# Altium schematic sheet Power_Reg.SchDoc
size A4
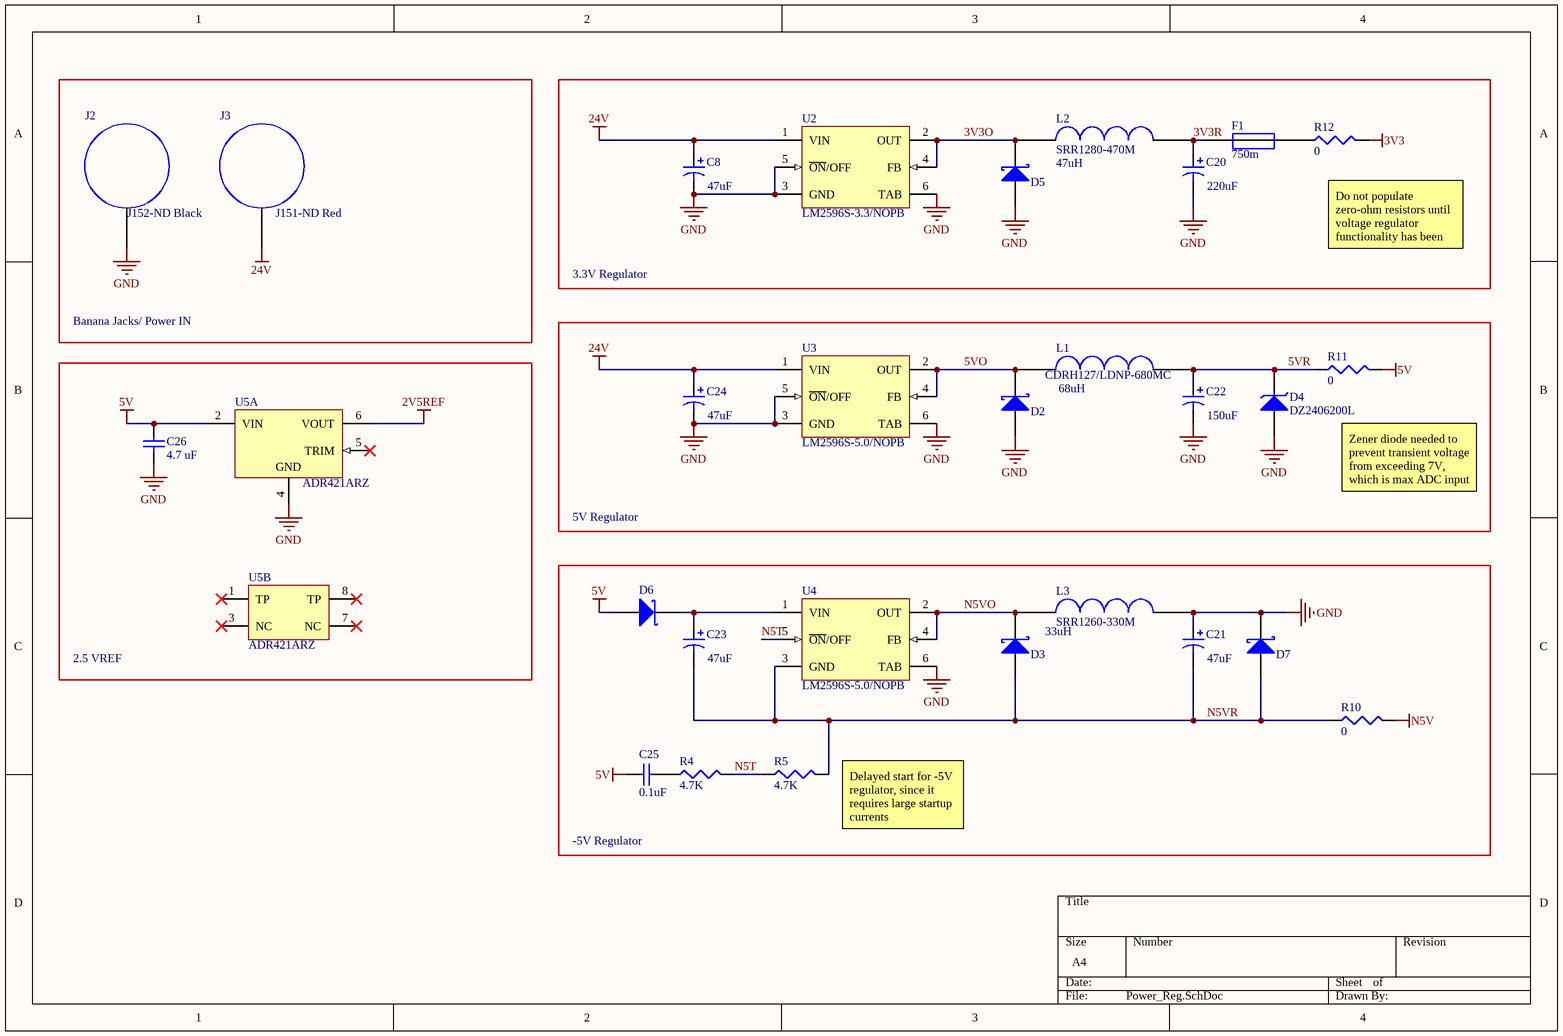
[diagram p0: Power_Reg.SchDoc]

## Parts
C8  value 47uF  [7343]  (hidden comment: 399-3905-2-ND)
C20  value 220uF  [7343]  (hidden comment: 399-10429-1-ND)
C21  value 47uF  [7343]  (hidden comment: 399-3905-2-ND)
C22  value 150uF  [7343]  (hidden comment: 399-3778-1-ND)
C23  value 47uF  [7343]  (hidden comment: 399-3905-2-ND)
C24  value 47uF  [7343]  (hidden comment: 399-3905-2-ND)
C25  value 0.1uF  [0402]  (hidden comment: C0402)
C26  value 4.7 uF  [0603]  (hidden comment: C0603)
D2  PMEG4050EP,115  [PMEG4050EP,115]  (value not drawn)
D3  PMEG4050EP,115  [PMEG4050EP,115]  (value not drawn)
D4  DZ2406200L  [DZ2406200L]
D5  PMEG4050EP,115  [PMEG4050EP,115]  (value not drawn)
D6  RSX501L-20TE25  [RSX501L-20TE25]  (value not drawn)
D7  PMEG4050EP,115  [PMEG4050EP,115]  (value not drawn)
F1  value 750m  [1206]  (hidden comment: TR/3216FF750-R)
J2  J152-ND Black  [Banana Jack]
J3  J151-ND Red  [Banana Jack]
L1  CDRH127/LDNP-680MC  value 68uH  [CDRH127/LDNP-680MC]
L2  SRR1280-470M  value 47uH  [SRR1280-470M]
L3  SRR1260-330M  value 33uH  [SRR1260-330M]
R4  value 4.7K  [J1-0603]  (hidden comment: Res3)
R5  value 4.7K  [J1-0603]  (hidden comment: Res3)
R10  value 0  [0805]  (hidden comment: 5106)
R11  value 0  [0805]  (hidden comment: 5106)
R12  value 0  [0805]  (hidden comment: 5106)
U2  LM2596S-3.3/NOPB  [TS5B_M]
U3  LM2596S-5.0/NOPB  [TS5B_M]
U4  LM2596S-5.0/NOPB  [TS5B_N]
U5  ADR421ARZ  [ADI-R-8_N]  (parts A,B of 2)

## Blocks framed on the sheet
Banana Jacks/ Power IN: J2 J3
3.3V Regulator: C8 C20 D5 F1 L2 R12 U2
5V Regulator: C22 C24 D2 D4 L1 R11 U3
2.5 VREF: C26 U5
-5V Regulator: C21 C23 C25 D3 D6 D7 L3 R4 R5 R10 U4

## Nets
2V5REF: U5.6(VOUT)
3V3: R12.2
5V: C25.2 C26.1 D6.1(A) R11.2 U5.2(VIN)
24V: C8.1 C24.1 J3.1 U2.1(VIN) U3.1(VIN)
GND: C8.2 C20.2 C21.1 C22.2 C24.2 C26.2 D2.1(A) D4.1(A) D5.1(A) D7.2(K) J2.1 L3.2 U2.3(GND) U2.5(~{ON}/OFF) U2.6(TAB) U3.3(GND) U3.5(~{ON}/OFF) U3.6(TAB) U4.6(TAB) U5.4(GND)
N5V: R10.2
3V3O: D5.2(K) L2.1 U2.2(OUT) U2.4(FB)
3V3R: C20.1 F1.1 L2.2
5VO: D2.2(K) L1.1 U3.2(OUT) U3.4(FB)
5VR: C22.1 D4.2(K) L1.2 R11.1
N5T: R4.2 R5.1 U4.5(~{ON}/OFF)
N5VO: D3.2(K) L3.1 U4.2(OUT) U4.4(FB)
N5VR: C21.2 C23.2 D3.1(A) D7.1(A) R5.2 R10.1 U4.3(GND)
NetC23_1: C23.1 D6.2(K) U4.1(VIN)
NetC25_1: C25.1 R4.1
NetF1_2: F1.2 R12.1

Not connected (* = marked no-connect by the designer): U5 1(TP)* 3(NC)* 5(TRIM)* 7(NC)* 8(TP)*

## Notes on the sheet
- (near R12) Do not populate zero-ohm resistors until voltage regulator functionality has been verified
- Zener diode needed to prevent transient voltage from exceeding 7V, which is max ADC input voltage
- (near R5) Delayed start for -5V regulator, since it requires large startup currents

## Library data of the parts
C8 C21 C23 C24 = CWR11DH476M: CAP TANT 47UF 35V 10% 2917; Note: See Data Sheet for full range of components; Published: 19-Mar-2004; DatasheetDocument: 20-Mar-2003; PackageReference: 7343; Publisher: Altium Limited; Code_JEITA: 7343; ComponentLink1Description: Manufacturer Link; ComponentLink1URL: http://www.vishay.com/; ComponentLink2Description: Datasheet; Supplier Part Number 1: 399-3905-1-ND; Supplier: Digikey
C20 = CWR11DH476M: CAP TANT 220uF 16V 10% 2917; Note: See Data Sheet for full range of components; Published: 19-Mar-2004; DatasheetDocument: 20-Mar-2003; PackageReference: 7343; Publisher: Altium Limited; Code_JEITA: 7343; ComponentLink1Description: Manufacturer Link; ComponentLink1URL: http://www.vishay.com/; ComponentLink2Description: Datasheet; Supplier Part Number 1: 399-10429-1-ND; Supplier: Digikey
C22 = CWR11DH476M: CAP TANT 150UF 10V 10% 2917; Note: See Data Sheet for full range of components; Published: 19-Mar-2004; DatasheetDocument: 20-Mar-2003; PackageReference: 7343; Publisher: Altium Limited; Code_JEITA: 7343; ComponentLink1Description: Manufacturer Link; ComponentLink1URL: http://www.vishay.com/; ComponentLink2Description: Datasheet; Supplier Part Number 1: 399-3778-1-ND; Supplier: Digikey
C25 = C0402: Ceramic Chip Capacitor - Standard; Note: Footprint corresponds to dimensions for bulk cassette packaging. This case size has tightened tolerances.; Published: 17-Jul-2002; LatestRevisionDate: 19-Mar-2004; LatestRevisionNote: Silkscreen size reduced.; DatasheetDocument: Mar-2001; PackageDocument: Mar-2001; PackageReference: 0402; Publisher: Altium Limited; Code_JEITA: 0402; Code_IPC: 1005 [0402]; ComponentLink1Description: Manufacturer Link; ComponentLink1URL: http://www.kemet.com/; ComponentLink2Description: Datasheet; ComponentLink2URL: http://www.kemet.com/kemet/web/homepage/kechome.nsf/vapubfilesname/F3102TA.pdf/$file/F3102TA.pdf; Supplier Part Number 1: 1276-1443-1-ND; Supplier 1: Digikey
C26 = C0603: Ceramic Chip Capacitor - Standard; Note: Footprint corresponds to dimensions for bulk cassette packaging. This case size has tightened tolerances.; Published: 17-Jul-2002; LatestRevisionDate: 19-Mar-2004; LatestRevisionNote: Silkscreen size reduced.; DatasheetDocument: Mar-2001; PackageDocument: Mar-2001; PackageReference: 0603; Publisher: Altium Limited; Code_JEITA: 0603; Code_IPC: 1608 [0603]; ComponentLink1Description: Manufacturer Link; ComponentLink1URL: http://www.kemet.com/; ComponentLink2Description: Datasheet; ComponentLink2URL: http://www.kemet.com/kemet/web/homepage/kechome.nsf/vapubfilesname/F3102TA.pdf/$file/F3102TA.pdf; Supplier Part Number 1: 445-7478-1-ND; Supplier 1: Digikey
D2 D3 D5 D7 = PMEG4050EP,115: Schottky Diode, 5A, 40V, SOD-128 Package; Supplier 1: Digikey; Supplier Part Number 1: 568-7408-1-ND
D4 = DZ2406200L: DIODE ZENER 6.2V 2W TMINIP2. SOD-128; Supplier 1: Digikey; Supplier Part Number 1: DZ2406200LCT-ND
D6 = RSX501L-20TE25: DIODE SCHOTTKY 20V 5A PMDS; Supplier 1: Digikey; Supplier Part Number 1: RSX501L-20TE25CT-ND
F1 = SF-0402F075-2: FUSE BOARD MNT 750MA 32VAC 63VDC; Supplier 1: Digikey; Supplier Part Number 1: 283-2540-1-ND
J2 = J-152-ND - Black: CONN JACK BANANA INSUL NYLON BLA; Supplier Part Number 1: J152-ND; Supplier 1: Digikey
J3 = J151-ND Red: CONN JACK BANANA INSUL NYLON RED; Supplier Part Number 1: J151-ND; Supplier 1: Digikey
L1 = CDRH127/LDNP-680MC: Non-standard package, shielded inductor, 68uH, 2.5A; Supplier 1: Digikey; Supplier Part Number 1: 308-1341-1-ND
L2 = SRR1280-470M: Non-standard, shielded, 47uH inductor; Supplier 1: Digikey; Supplier Part Number 1: SRR1280-470MCT-ND
L3 = SRR1260-330M: Non-standard, shielded, inductor, 33uH; Supplier Part Number 1: SRR1260-330M; Supplier 1: Digikey
R4 R5 = Res3: Resistor; Published: 8-Jun-2000; LatestRevisionDate: 29-May-2009; LatestRevisionNote: IPC-7351 Footprint Added.; PackageReference: J1-0603; Publisher: Altium Limited; PackageDescription: Chip Resistor; Supplier Part Number 1: 311-4.7KGRCT-ND; Supplier: Digikey
R10-R12 = Res3: RES SMD 0.0 OHM JUMPER 1/2W 0805; Published: 8-Jun-2000; LatestRevisionDate: 29-May-2009; LatestRevisionNote: IPC-7351 Footprint Added.; PackageReference: J1-0603; Publisher: Altium Limited; PackageDescription: Chip Resistor; Supplier 1: Digikey; Supplier Part Number 1: 36-5106CT-ND
U2 = LM2596S-3.3/NOPB: SIMPLE SWITCHER® Power Converter 150 KHz 3A Step-Down Voltage Regulator, 5-pin TO-263, Pb-Free; Manufacturer: National Semiconductor; PackageTopMarking: NSUZXYTTE#*LM2596S*-3.3 P+; PowerWise: N; High-Reliability: Y; DatasheetVersion: May-2002; PackageVersion: revD, Apr-2005; PackageReference: TS5B; PackageDescription: TO-263, Molded, .400 x .390 x .180in, 5 Lead, .067in Pitch, Surface Mount; PartNumber: LM2596S-3.3/NOPB; RoHS: Y; PinCount: 5; CompType: Switcher; Code_JEDEC: MO-169-AB; ComponentLink1Description: Manufacturer URL; ComponentLink1URL: http://www.national.com/; ComponentLink2Description: LM2596 Datasheet; ComponentLink2URL: http://www.national.com/ds/LM/LM2596.pdf; ComponentLink3Description: LM2596 Web Page; ComponentLink3URL: http://www.national.com/pf/LM/LM2596.html; ComponentLink4Description: TS5B Package Page; ComponentLink4URL: http://www.national.com/packaging/folders/ts5b.html
U3 U4 = LM2596S-5.0/NOPB: SIMPLE SWITCHER® Power Converter 150 KHz 3A Step-Down Voltage Regulator, 5-pin TO-263, Pb-Free; Manufacturer: National Semiconductor; PackageTopMarking: NSUZXYTTE#*LM2596S*-5.0 P+; PowerWise: N; High-Reliability: Y; DatasheetVersion: May-2002; PackageVersion: revD, Apr-2005; PackageReference: TS5B; PackageDescription: TO-263, Molded, .400 x .390 x .180in, 5 Lead, .067in Pitch, Surface Mount; PartNumber: LM2596S-5.0/NOPB; RoHS: Y; PinCount: 5; CompType: Switcher; Code_JEDEC: MO-169-AB; ComponentLink1Description: Manufacturer URL; ComponentLink1URL: http://www.national.com/; ComponentLink2Description: LM2596 Datasheet; ComponentLink2URL: http://www.national.com/ds/LM/LM2596.pdf; ComponentLink3Description: LM2596 Web Page; ComponentLink3URL: http://www.national.com/pf/LM/LM2596.html; ComponentLink4Description: TS5B Package Page; ComponentLink4URL: http://www.national.com/packaging/folders/ts5b.html
U5 = ADR421ARZ: Ultraprecision, Low Noise, XFET(R) Voltage Reference, 2.5 V Output, 4.5 to 18 V Supply, Industrial, 8-pin SOIC (R-8), Tube; Manufacturer: Analog Devices; Max V Supply (V): 18; Min V Supply (V): 4.5; Ref Out TC (ppm/C): 2; Vout: 2.5V; DatasheetVersion: Rev. I; PackageVersion: 060506-A, 06/2006; PackageReference: R-8; PackageDescription: 8-Pin Standard Small Outline Package, Body 4.9 x 3.9 mm, Pitch 1.27 mm; Supplier 1: Digi-Key; Supplier Part Number 1: ADR421ARZ-ND; Supplier 2: Farnell; Supplier Part Number 2: 9426094; Supplier 3: Mouser; Supplier Part Number 3: 584-ADR421ARZ; Packing: Tube; Operating Temp Range: -40 to 125 degC; Mounting Technology: Surface Mount; Code_JEDEC: MS-012-AA; PartNumber: ADR421ARZ; ComponentLink1Description: Manufacturer URL; ComponentLink1URL: http://www.analog.com/en/index.html; ComponentLink2Description: Datasheet; ComponentLink2URL: http://www.analog.com/static/imported-files/data_sheets/ADR420_421_423_425.pdf; ComponentLink3Description: Package Specification; ComponentLink3URL: http://www.analog.com/static/imported-files/packages/PKG_PDF/SOIC_Narrow%20(R)/R_8.pdf; ComponentLink4Description: URL Link1; ComponentLink4URL: Product URL:http://www.analog.com/en/special-linear-functions/voltage-references/adr421/products/product.html